# Altium schematic sheet SimpleMonitorUSBAER.SCHDOC
size A; Author: T Delbruck; CompanyName: INI; DrawnBy: T Delbruck; Engineer: T Delbruck; Organization: INI; Address1: tobi@ini.phys.ethz.ch; DocumentName: SimpleMonitorUSBXPress
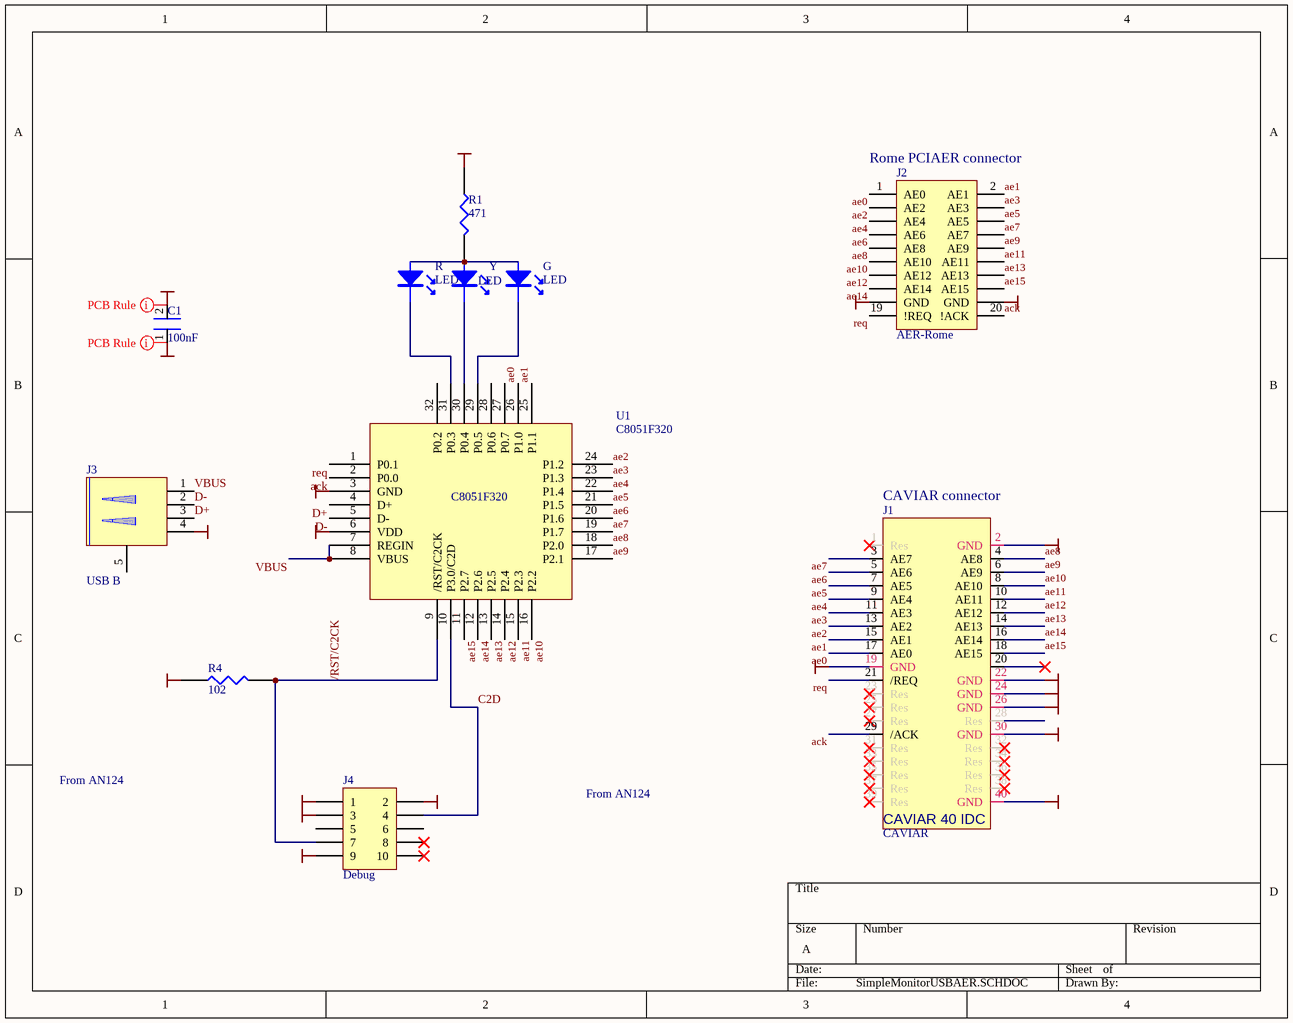
[diagram p0: SimpleMonitorUSBAER.SCHDOC]

## Parts
C1  100nF  [CC3216-1206]
G  LED  [0805LED]
J1  CAVIAR  [HDR2X20 with shell]
J2  AER-Rome  [HDR10x2 w/clips]
J3  USB B  [usb]
J4  Debug  [HDR2X5]
R  LED  [0805LED]
R1  471  [CR2012-0805]
R4  102  [CR2012-0805]
U1  C8051F320  [TQFP32]
Y  LED  [0805LED]

## Nets
GND: C1.1 J1.2(GND) J1.19(GND) J1.22(GND) J1.24(GND) J1.26(GND) J1.30(GND) J1.40(GND) J2.17(GND) J2.18(GND) J3.4 J4.2 J4.3 J4.9 U1.3(GND)
VDD: C1.2 J4.1 R1.1 R4.1 U1.6(VDD)
/RST/C2CK: J4.7 R4.2 U1.9(/RST/C2CK)
ack: J1.29(/ACK) J2.20(!ACK) U1.2(P0.0)
ae0: J1.17(AE0) J2.1(AE0) U1.26(P1.0)
ae1: J1.15(AE1) J2.2(AE1) U1.25(P1.1)
ae2: J1.13(AE2) J2.3(AE2) U1.24(P1.2)
ae3: J1.11(AE3) J2.4(AE3) U1.23(P1.3)
ae4: J1.9(AE4) J2.5(AE4) U1.22(P1.4)
ae5: J1.7(AE5) J2.6(AE5) U1.21(P1.5)
ae6: J1.5(AE6) J2.7(AE6) U1.20(P1.6)
ae7: J1.3(AE7) J2.8(AE7) U1.19(P1.7)
ae8: J1.4(AE8) J2.9(AE8) U1.18(P2.0)
ae9: J1.6(AE9) J2.10(AE9) U1.17(P2.1)
ae10: J1.8(AE10) J2.11(AE10) U1.16(P2.2)
ae11: J1.10(AE11) J2.12(AE11) U1.15(P2.3)
ae12: J1.12(AE12) J2.13(AE12) U1.14(P2.4)
ae13: J1.14(AE13) J2.14(AE13) U1.13(P2.5)
ae14: J1.16(AE14) J2.15(AE14) U1.12(P2.6)
ae15: J1.18(AE15) J2.16(AE15) U1.11(P2.7)
C2D: J4.4 U1.10(P3.0/C2D)
D+: J3.3 U1.4(D+)
D-: J3.2 U1.5(D-)
req: J1.21(/REQ) J2.19(!REQ) U1.1(P0.1)
VBUS: J3.1 U1.7(REGIN) U1.8(VBUS)
NetG_+: G.+ R.+ R1.2 Y.+
NetG_-: G.- U1.29(P0.5)
NetR_-: R.- U1.31(P0.3)
NetU1_30: U1.30(P0.4) Y.-

Not connected (* = marked no-connect by the designer): J1 1(Res)* 20* 23(Res)* 25(Res)* 27(Res)* 28(Res) 31(Res)* 32(Res)* 33(Res)* 34(Res)* 35(Res)* 36(Res)* 37(Res)* 38(Res)* 39(Res)*; J3 5; J4 5 6 8* 10*; U1 27(P0.7) 28(P0.6) 32(P0.2)

## Layout directives
rule Width Constraint [Pref Width = 20mil    Min Width = 10mil    Max Width = 60mil]: GND, VDD

## Notes on the sheet
- (near J2) Rome PCIAER connector
- (near J1) CAVIAR connector
- From AN124

## Library data of the parts
C1 = CAPCHIP
G R Y = LED: LED, SMT 3mm by 1.5mm
J1 = CAVIAR 40 IDC: CAVIAR 40 pin IDC header
J2 = Header AER-ROME: AER-Rome 20-Pin, Dual row, with IDC mounting clips; Manufacturer: Generic Components; Class: Connector
J3 = USB: USB TypB
J4 = Header 5X2: Header, 5-Pin, Dual row; Revision: 17-Jul-2002: Re-released for DXP Platform.; Publisher: Altium Limited
R1 R4 = RES1
U1 = C8051F320: Silicon Labs USB Microcontroller